# EAGLE design main (EAGLE 6.2)
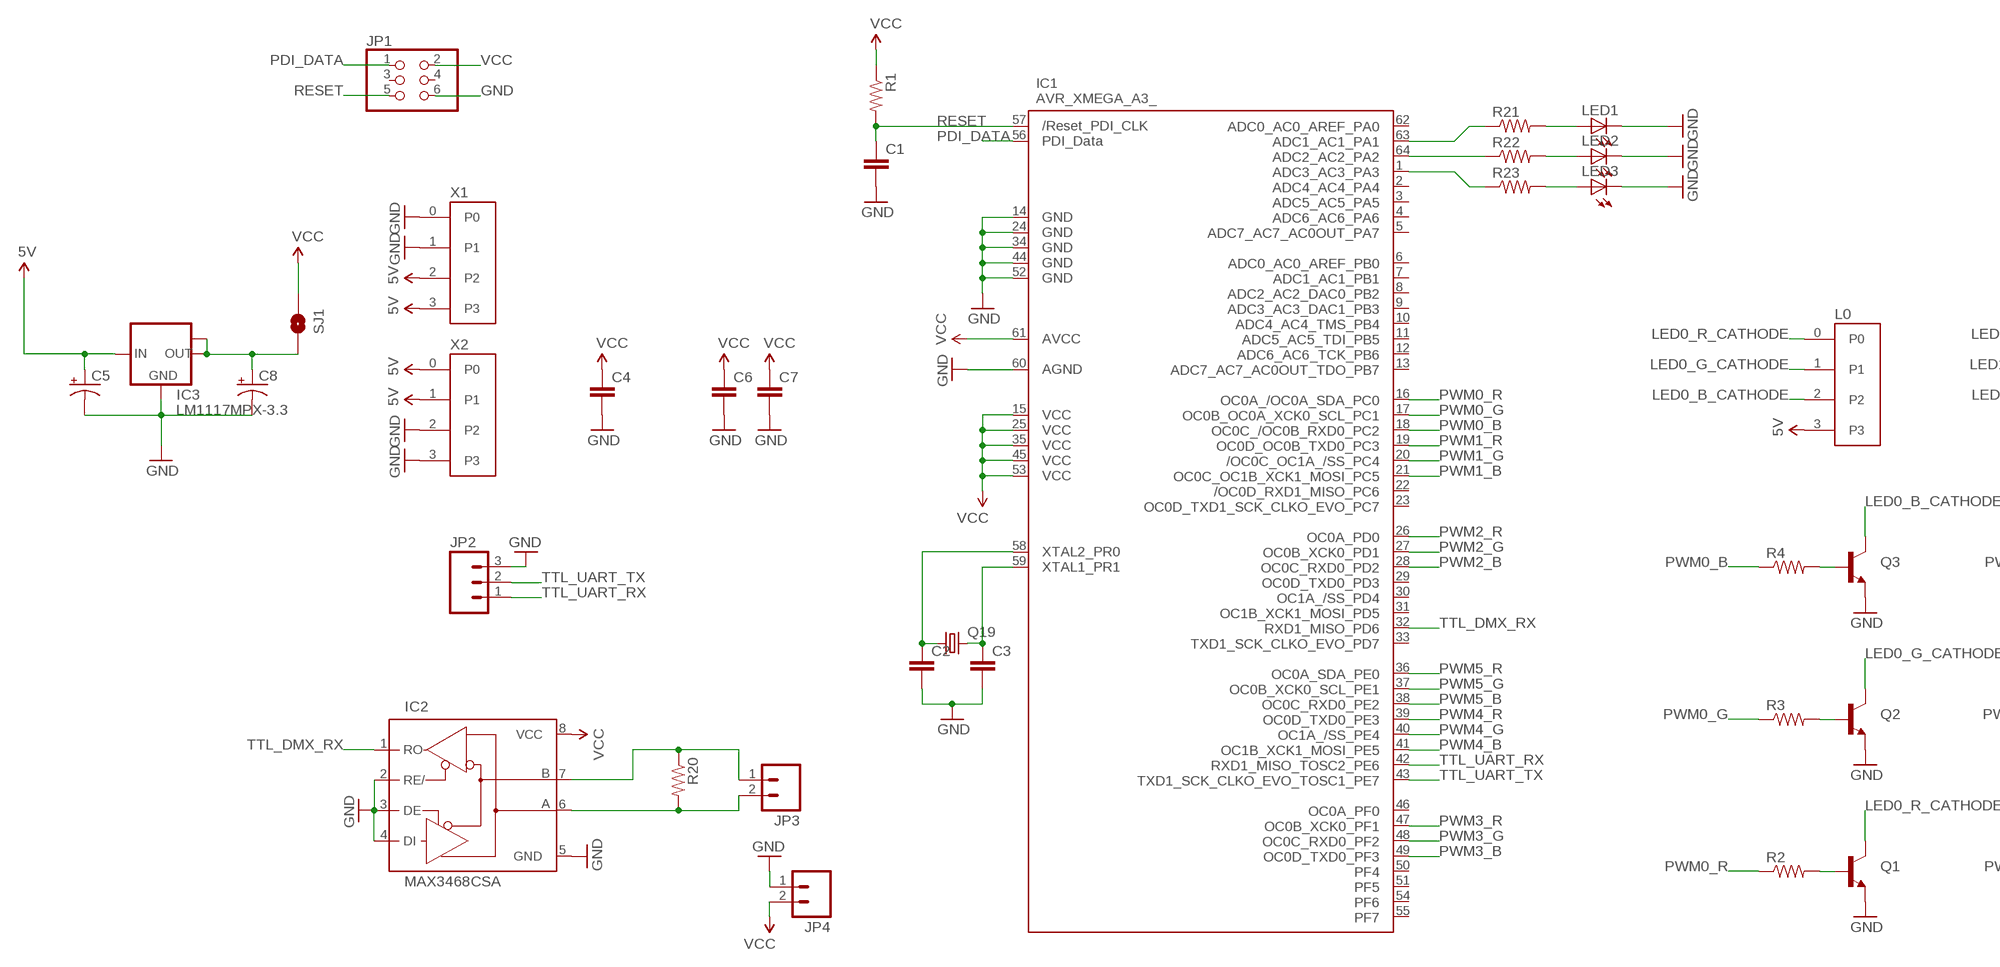
[diagram p0: schematic, sheet 1, part 1 of 2]
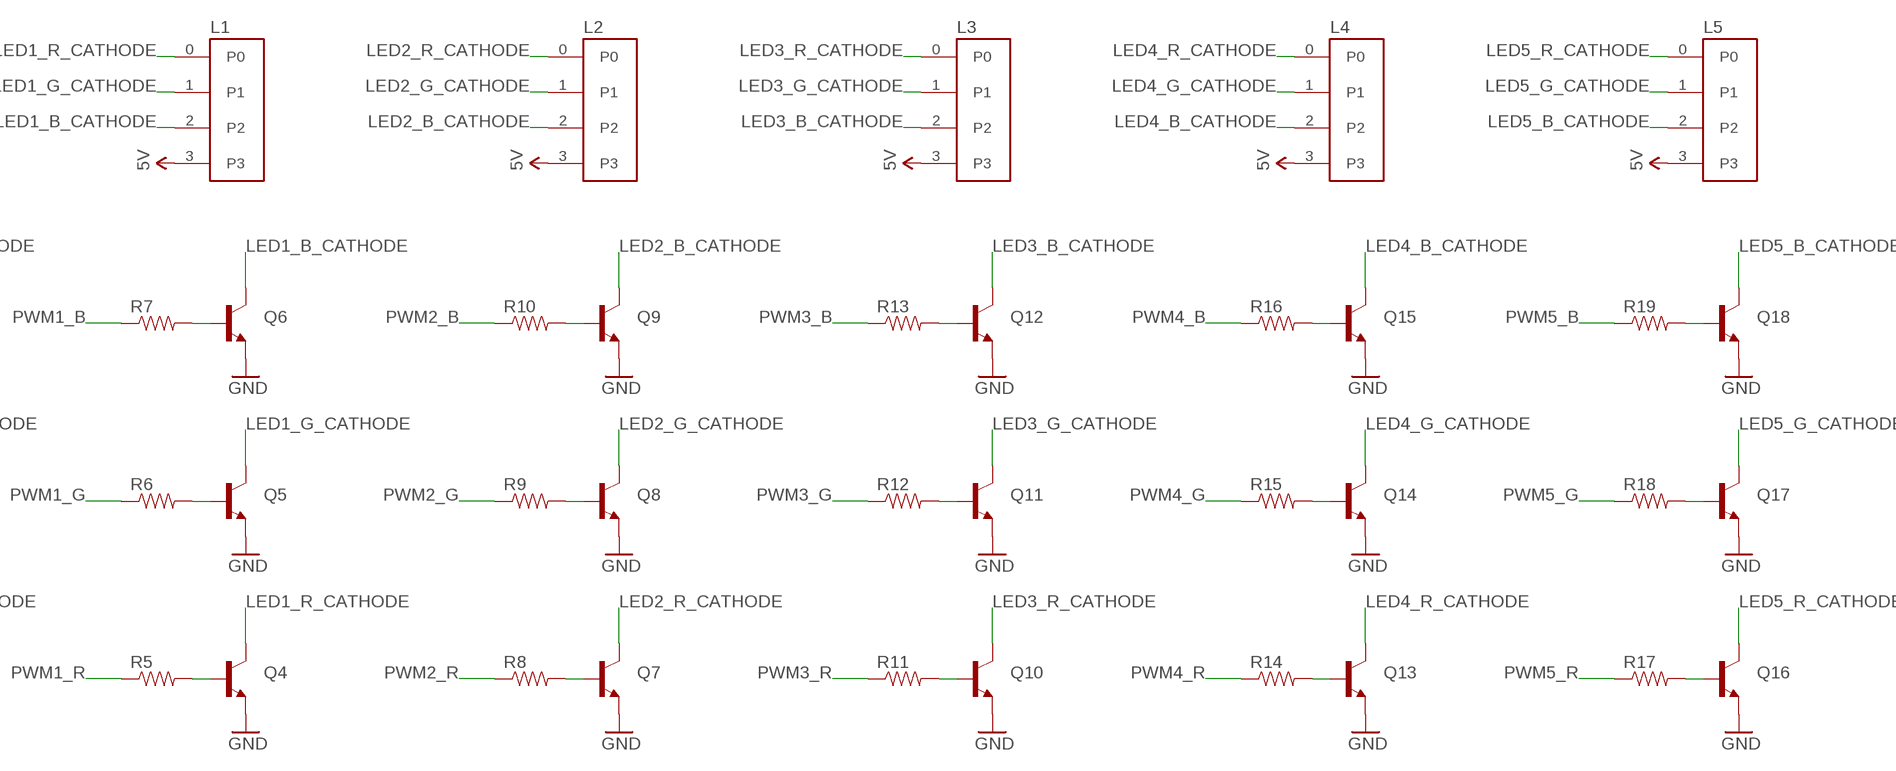
[diagram p1: schematic, sheet 1, part 2 of 2]

## Parts
C1  CAP0805  [0805]
C2  CAP0805  [0805]
C3  CAP0805  [0805]
C4  CAP0805  [0805]
C5  CAP_POLSMD  [VISHAY_C]
C6  CAP0805  [0805]
C7  CAP0805  [0805]
C8  CAP_POLSMD  [VISHAY_C]
IC1  AVR_XMEGA_A3_  [TQFP64]
IC2  MAX3468CSA  [SO08]
IC3  LM1117MPX-3.3  [SOT223]
JP1  PINHD-2X3  [2X03]
JP2  M03LOCK_LONGPADS  [1X03_LOCK_LONGPADS]
JP3  M02  [1X02_LONGPADS]
JP4  M02  [1X02_LONGPADS]
L0  SCREW-TERMINAL-4P  [SK-CZZ-4P]
L1  SCREW-TERMINAL-4P  [SK-CZZ-4P]
L2  SCREW-TERMINAL-4P  [SK-CZZ-4P]
L3  SCREW-TERMINAL-4P  [SK-CZZ-4P]
L4  SCREW-TERMINAL-4P  [SK-CZZ-4P]
L5  SCREW-TERMINAL-4P  [SK-CZZ-4P]
LED1  LEDCHIPLED_0805  [CHIPLED_0805]
LED2  LEDCHIPLED_0805  [CHIPLED_0805]
LED3  LEDCHIPLED_0805  [CHIPLED_0805]
Q1  TRANSISTOR_NPNSOT89  [SOT89]
Q2  TRANSISTOR_NPNSOT89  [SOT89]
Q3  TRANSISTOR_NPNSOT89  [SOT89]
Q4  TRANSISTOR_NPNSOT89  [SOT89]
Q5  TRANSISTOR_NPNSOT89  [SOT89]
Q6  TRANSISTOR_NPNSOT89  [SOT89]
Q7  TRANSISTOR_NPNSOT89  [SOT89]
Q8  TRANSISTOR_NPNSOT89  [SOT89]
Q9  TRANSISTOR_NPNSOT89  [SOT89]
Q10  TRANSISTOR_NPNSOT89  [SOT89]
Q11  TRANSISTOR_NPNSOT89  [SOT89]
Q12  TRANSISTOR_NPNSOT89  [SOT89]
Q13  TRANSISTOR_NPNSOT89  [SOT89]
Q14  TRANSISTOR_NPNSOT89  [SOT89]
Q15  TRANSISTOR_NPNSOT89  [SOT89]
Q16  TRANSISTOR_NPNSOT89  [SOT89]
Q17  TRANSISTOR_NPNSOT89  [SOT89]
Q18  TRANSISTOR_NPNSOT89  [SOT89]
Q19  CRYSTALHC49UP  [HC49UP]
R1  RESISTOR  [0805]
R2  RESISTOR  [0805]
R3  RESISTOR  [0805]
R4  RESISTOR  [0805]
R5  RESISTOR  [0805]
R6  RESISTOR  [0805]
R7  RESISTOR  [0805]
R8  RESISTOR  [0805]
R9  RESISTOR  [0805]
R10  RESISTOR  [0805]
R11  RESISTOR  [0805]
R12  RESISTOR  [0805]
R13  RESISTOR  [0805]
R14  RESISTOR  [0805]
R15  RESISTOR  [0805]
R16  RESISTOR  [0805]
R17  RESISTOR  [0805]
R18  RESISTOR  [0805]
R19  RESISTOR  [0805]
R20  RESISTOR  [0805]
R21  RESISTOR  [0805]
R22  RESISTOR  [0805]
R23  RESISTOR  [0805]
SJ1  SOLDERJUMPERNO  [SJ_2S-NO]
X1  SCREW-TERMINAL-4P  [SK-CZZ-4P]
X2  SCREW-TERMINAL-4P  [SK-CZZ-4P]

## Nets
5V: C5.+ IC3.3(IN) L0.3 L1.3 L2.3 L3.3 L4.3 L5.3 X1.2 X1.3 X2.0 X2.1
GND: C1.2 C2.2 C3.2 C4.2 C5.- C6.2 C7.2 C8.- IC1.14(GND1) IC1.24(GND2) IC1.34(GND3) IC1.44(GND4) IC1.52(GND5) IC1.60(AGND) IC2.2(RE/) IC2.3(DE) IC2.4(DI) IC2.5(GND) IC3.1(GND) JP1.6 JP2.3 JP4.1 LED1.C LED2.C LED3.C Q1.3(E) Q2.3(E) Q3.3(E) Q4.3(E) Q5.3(E) Q6.3(E) Q7.3(E) Q8.3(E) Q9.3(E) Q10.3(E) Q11.3(E) Q12.3(E) Q13.3(E) Q14.3(E) Q15.3(E) Q16.3(E) Q17.3(E) Q18.3(E) X1.0 X1.1 X2.2 X2.3
LED0_B_CATHODE: L0.2 Q3.2(C)
LED0_G_CATHODE: L0.1 Q2.2(C)
LED0_R_CATHODE: L0.0 Q1.2(C)
LED1_B_CATHODE: L1.2 Q6.2(C)
LED1_G_CATHODE: L1.1 Q5.2(C)
LED1_R_CATHODE: L1.0 Q4.2(C)
LED2_B_CATHODE: L2.2 Q9.2(C)
LED2_G_CATHODE: L2.1 Q8.2(C)
LED2_R_CATHODE: L2.0 Q7.2(C)
LED3_B_CATHODE: L3.2 Q12.2(C)
LED3_G_CATHODE: L3.1 Q11.2(C)
LED3_R_CATHODE: L3.0 Q10.2(C)
LED4_B_CATHODE: L4.2 Q15.2(C)
LED4_G_CATHODE: L4.1 Q14.2(C)
LED4_R_CATHODE: L4.0 Q13.2(C)
LED5_B_CATHODE: L5.2 Q18.2(C)
LED5_G_CATHODE: L5.1 Q17.2(C)
LED5_R_CATHODE: L5.0 Q16.2(C)
N$1: Q1.1(B) R2.2
N$2: Q2.1(B) R3.2
N$3: Q3.1(B) R4.2
N$4: Q4.1(B) R5.2
N$5: Q5.1(B) R6.2
N$6: Q6.1(B) R7.2
N$7: Q7.1(B) R8.2
N$8: Q8.1(B) R9.2
N$9: Q9.1(B) R10.2
N$10: Q10.1(B) R11.2
N$11: Q11.1(B) R12.2
N$12: Q12.1(B) R13.2
N$13: Q13.1(B) R14.2
N$14: Q14.1(B) R15.2
N$15: Q15.1(B) R16.2
N$16: Q16.1(B) R17.2
N$17: Q17.1(B) R18.2
N$18: Q18.1(B) R19.2
N$19: C2.1 IC1.58(PR0) Q19.1
N$20: C3.1 IC1.59(PR1) Q19.2
N$21: IC2.7(B) JP3.1 R20.1
N$22: IC2.6(A) JP3.2 R20.2
N$23: IC1.63(PA1) R21.1
N$24: C8.+ IC3.2(OUT) IC3.TAB(OUT1) SJ1.2
N$25: IC1.64(PA2) R22.1
N$26: IC1.1(PA3) R23.1
N$27: LED1.A R21.2
N$28: LED2.A R22.2
N$29: LED3.A R23.2
PDI_DATA: IC1.56(PDI_DATA) JP1.1
PWM0_B: IC1.18(PC2) R4.1
PWM0_G: IC1.17(PC1) R3.1
PWM0_R: IC1.16(PC0) R2.1
PWM1_B: IC1.21(PC5) R7.1
PWM1_G: IC1.20(PC4) R6.1
PWM1_R: IC1.19(PC3) R5.1
PWM2_B: IC1.28(PD2) R10.1
PWM2_G: IC1.27(PD1) R9.1
PWM2_R: IC1.26(PD0) R8.1
PWM3_B: IC1.49(PF3) R13.1
PWM3_G: IC1.48(PF2) R12.1
PWM3_R: IC1.47(PF1) R11.1
PWM4_B: IC1.41(PE5) R16.1
PWM4_G: IC1.40(PE4) R15.1
PWM4_R: IC1.39(PE3) R14.1
PWM5_B: IC1.38(PE2) R19.1
PWM5_G: IC1.37(PE1) R18.1
PWM5_R: IC1.36(PE0) R17.1
RESET: C1.1 IC1.57(RESET) JP1.5 R1.2
TTL_DMX_RX: IC1.32(PD6) IC2.1(RO)
TTL_UART_RX: IC1.42(PE6) JP2.1
TTL_UART_TX: IC1.43(PE7) JP2.2
VCC: C4.1 C6.1 C7.1 IC1.15(VCC1) IC1.25(VCC2) IC1.35(VCC3) IC1.45(VCC4) IC1.53(VCC5) IC1.61(AVCC) IC2.8(VCC) JP1.2 JP4.2 R1.1 SJ1.1
Unconnected: IC1.2(PA4) IC1.3(PA5) IC1.4(PA6) IC1.5(PA7) IC1.6(PB0) IC1.7(PB1) IC1.8(PB2) IC1.9(PB3) IC1.10(PB4) IC1.11(PB5) IC1.12(PB6) IC1.13(PB7) IC1.22(PC6) IC1.23(PC7) IC1.29(PD3) IC1.30(PD4) IC1.31(PD5) IC1.33(PD7) IC1.46(PF0) IC1.50(PF4) IC1.51(PF5) IC1.54(PF6) IC1.55(PF7) IC1.62(PA0) JP1.3 JP1.4

## Library data of the parts
C1-C4 C6 C7 = SparkFun:CAP: Capacitor Standard 0603 ceramic capacitor, and 0.1" leaded capacitor.
C5 C8 = SparkFun:CAP_POL: Capacitor Polarized These are standard SMD and PTH capacitors. Normally 10uF, 47uF, and 100uF in electrolytic and tantalum varieties. Always verify the external diameter of the through hole cap, it varies with capacity, voltage, and manufacturer. The EIA devices should be standard.
IC1 = xmega:AVR_XMEGA_A3_: Device for Atmel AVR XMEGA A3 Series
IC2 = maxim:MAX34*: +5V, Fail-Safe, 40Mbps, Profibus RS-485/RS-422 Transceivers Source: MAX3465-MAX3469.pdf
IC3 = lm1117:LM1117MPX-*
JP1 = SparkFun:PINHD-2X3: PIN HEADER
JP2 = SparkFun:M03: Header 3 Standard 3-pin 0.1" header. Use with straight break away headers (SKU : PRT-00116), right angle break away headers (PRT-00553), swiss pins (PRT-00743), machine pins (PRT-00117), and female headers (PRT-00115). Molex polarized connector foot print use with SKU : PRT-08232 with associated crimp pins and housings.
JP3 JP4 = SparkFun:M02: Header 2 Standard 2-pin 0.1" header. Use with straight break away headers (SKU : PRT-00116), right angle break away headers (PRT-00553), swiss pins (PRT-00743), machine pins (PRT-00117), and female headers (PRT-00115). Molex polarized connector foot print use with SKU : PRT-08233 with associated crimp pins and housings.
L0 L1-L5 X1 X2 = terminals:SCREW-TERMINAL-4P: Screw Terminal from Stelvio-Kontek https://www1.elfa.se/data1/wwwroot/assets/datasheets/04837407.pdf Elfa: 48-375-22
LED1-LED3 = led:LED: LED OSRAM: - CHIPLED LG R971, LG N971, LY N971, LG Q971, LY Q971, LO R971, LY R971 LH N974, LH R974 LS Q976, LO Q976, LY Q976 LO Q996 - Hyper CHIPLED LW Q18S LB Q993, LB Q99A, LB R99A - SideLED LS A670, LO A670, LY A670, LG A670, LP A670 LB A673, LV A673, LT A673, LW A673 LH A674 LY A675 LS A676, LA A676, LO A676, LY A676, LW A676 LS A679, LY A679, LG A679 - Hyper Micro SIDELED® LS Y876, LA Y876, LO Y876, LY Y876 LT Y87S - SmartLED LW L88C, LW L88S LB L89C, LB L89S, LG L890 LS L89K, LO L89K, LY L89K LS L896, LA L896, LO L896, LY L896 - TOPLED LS T670, LO T670, LY T670, LG T670, LP T670 LSG T670, LSP T670, LSY T670, LOP T670, LYG T670 LG T671, LOG T671, LSG T671 LB T673, LV T673, LT T673, LW T673 LH T674 LS T676, LA T676, LO T676, LY T676, LB T676, LH T676, LSB T676, LW T676 LB T67C, LV T67C, LT T67C, LS T67K, LO T67K, LY T67K, LW E67C LS E67B, LA E67B, LO E67B, LY E67B, LB E67C, LV E67C, LT E67C LW T67C LS T679, LY T679, LG T679 LS T770, LO T770, LY T770, LG T770, LP T770 LB T773, LV T773, LT T773, LW T773 LH T774 LS E675, LA E675, LY E675, LS T675 LS T776, LA T776, LO T776, LY T776, LB T776 LHGB T686 LT T68C, LB T68C - Hyper Mini TOPLED® LB M676 - Mini TOPLED Santana® LG M470 LS M47K, LO M47K, LY M47K Source: http://www.osram.convergy.de LUXEON: - LUMILED® LXK2-PW12-R00, LXK2-PW12-S00, LXK2-PW14-U00, LXK2-PW14-V00 LXK2-PM12-R00, LXK2-PM12-S00, LXK2-PM14-U00 LXK2-PE12-Q00, LXK2-PE12-R00, LXK2-PE12-S00, LXK2-PE14-T00, LXK2-PE14-U00 LXK2-PB12-K00, LXK2-PB12-L00, LXK2-PB12-M00, LXK2-PB14-N00, LXK2-PB14-P00, LXK2-PB14-Q00 LXK2-PR12-L00, LXK2-PR12-M00, LXK2-PR14-Q00, LXK2-PR14-R00 LXK2-PD12-Q00, LXK2-PD12-R00, LXK2-PD12-S00 LXK2-PH12-R00, LXK2-PH12-S00 LXK2-PL12-P00, LXK2-PL12-Q00, LXK2-PL12-R00 Source: www.luxeon.com KINGBRIGHT: KA-3528ASYC Source: www.kingbright.com
Q1-Q18 = sot89_lengrebein:TRANSISTOR_NPN: Transistor NPN BJT configuration in SOT23 package. MMBT2222 is the common NPN we use. Double check BCE configuration again layout.
Q19 = crystal:CRYSTAL: CRYSTAL
R1-R23 = SparkFun:RESISTOR: Resistor Basic schematic elements and footprints for 0603, 1206, and PTH 1/10th watt (small) resistors.
SJ1 = SparkFun:SOLDERJUMPER: Solder Jumper Standard SMD solder jumper. Used to automate production. Two varients : Normally Open and Normally Closed are the same, but have different paste layers. NC will have a large amount of paste and should jumper during reflow.

## Board
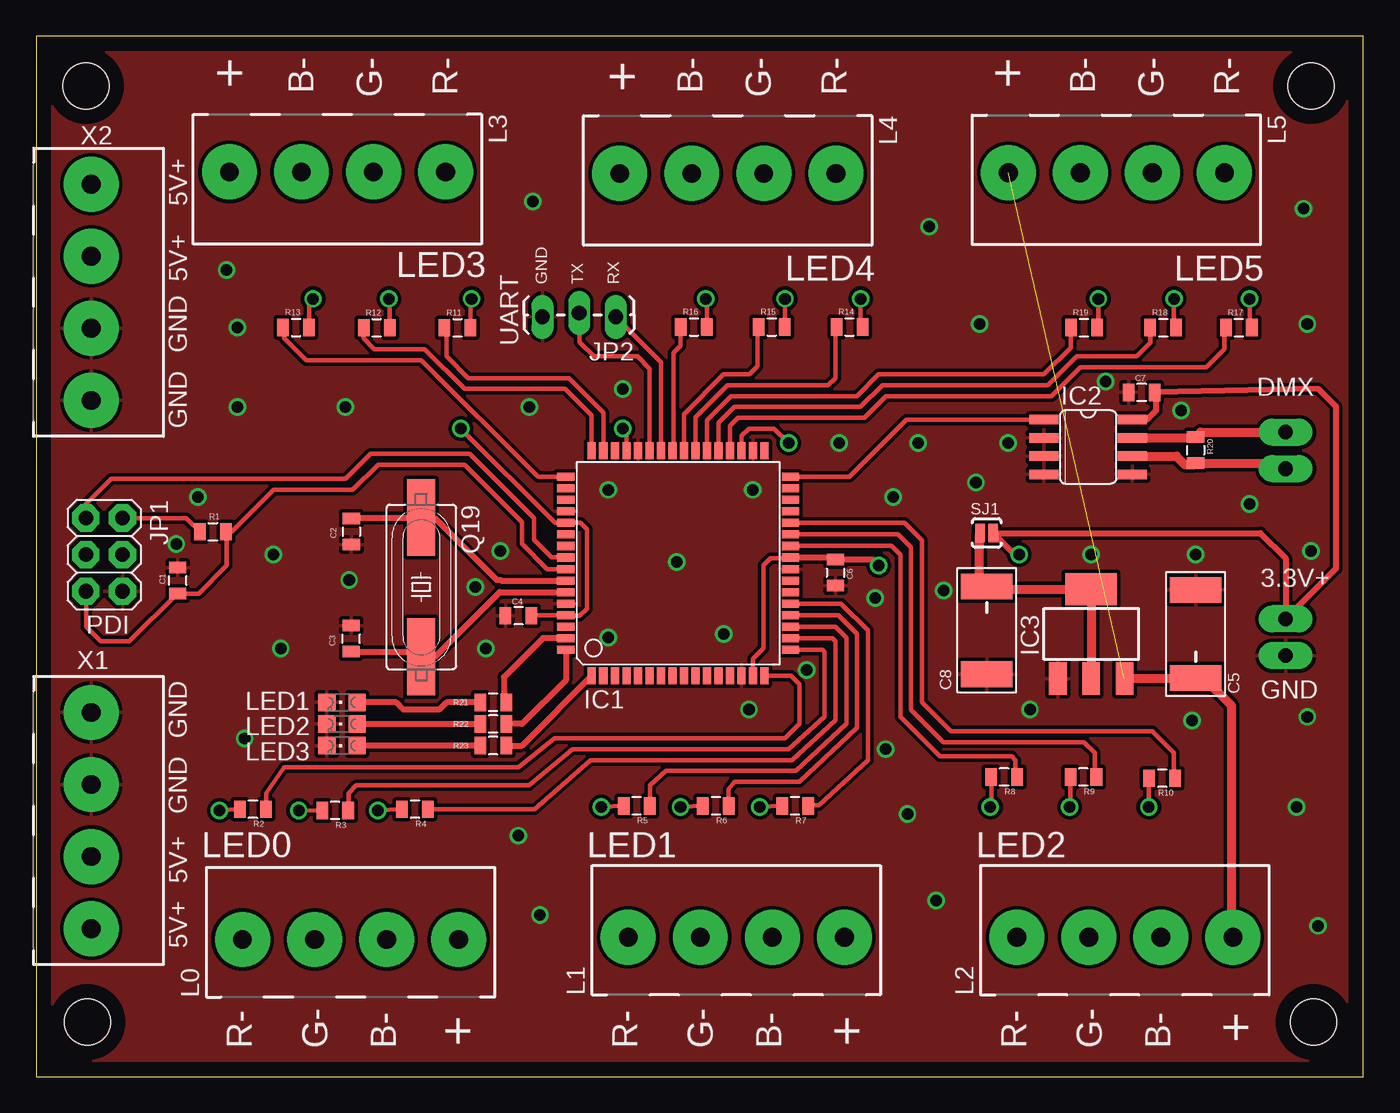
[diagram p2: board, top side]
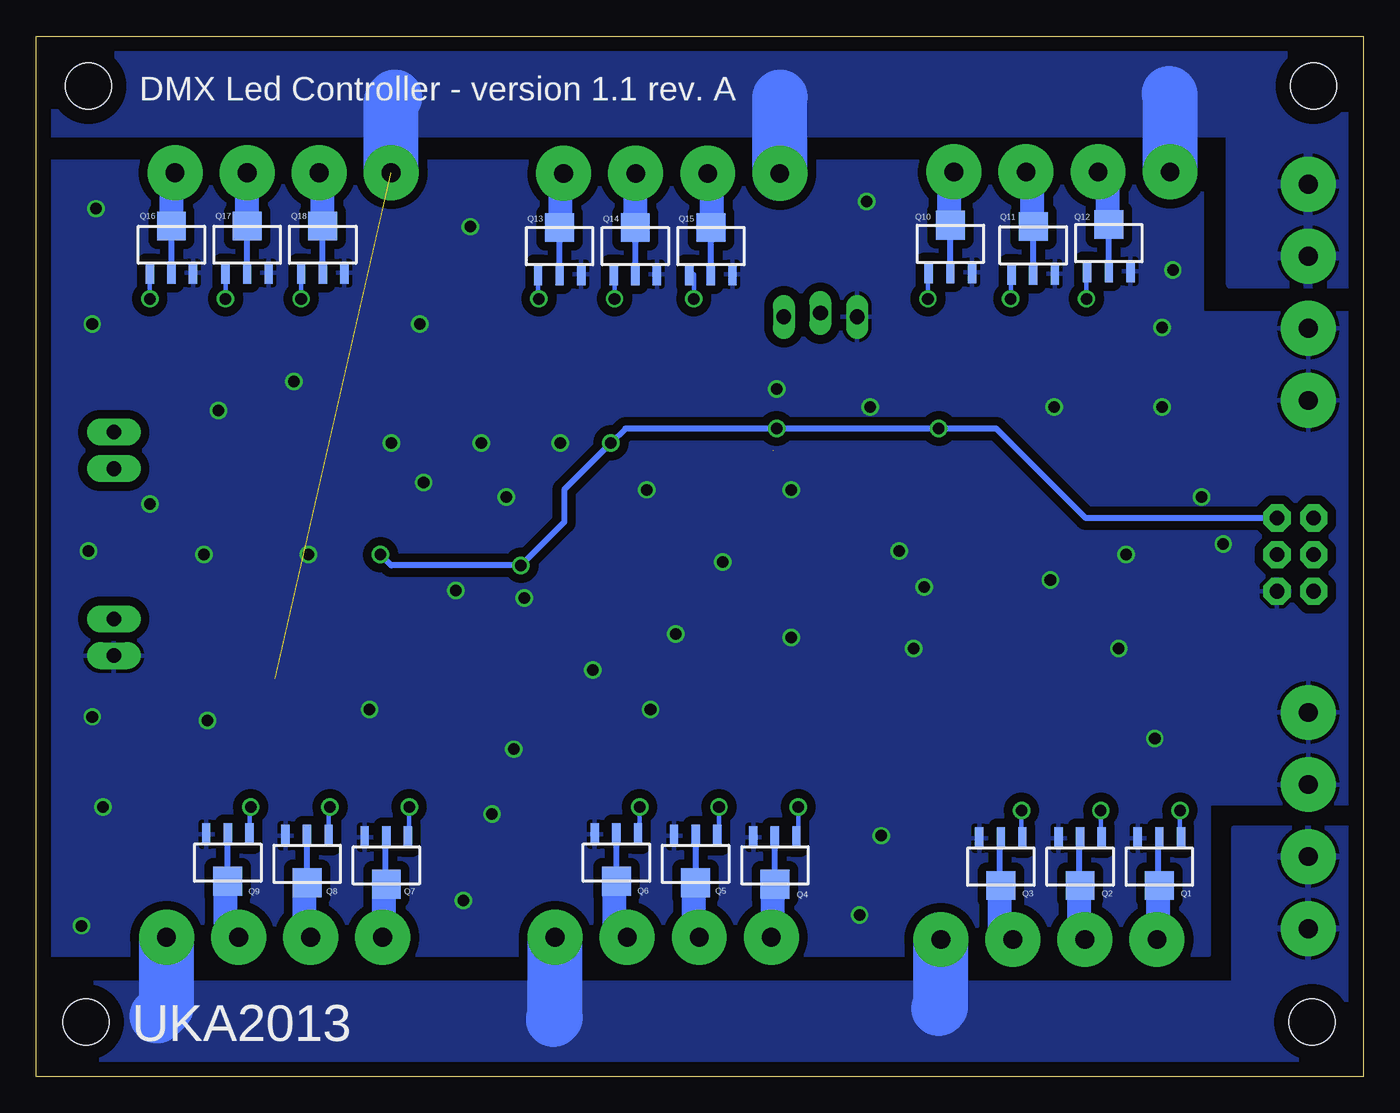
[diagram p3: board, bottom side, seen from below]

Size 92.13 x 72.21 mm. Coordinates in mm from the lower left corner, seen from the top.
Outline: 0,0 92.13,0 92.13,72.21 0,72.21 0,0
Copper layers (1*16): Top 0.035mm / dielectric 1.5mm / Bottom 0.035mm
Design rules: minimum track width 10mil, minimum drill 24mil, track to track 8mil, track to pad 8mil, pad to pad 8mil, via to via 8mil, smd to smd 8mil, copper to edge 40mil, drill to drill 8mil, minimum pad ring 10mil, minimum via ring 8mil, stop-mask expansion 4mil, vias tented up to drill 0mil, thermal gap 10mil
Holes 3.2 mm at 3.56,3.81 88.65,3.81 3.48,68.73 88.48,68.73

### Footprints (pad centres in the part's own frame; a part is rotated, then mirrored left to right if it is on the bottom)
0805 = smd 0.8 x 1.2: 1 -0.9,0; 2 0.9,0
VISHAY_C = smd 3.556 x 1.778: + 0,3.048; - 0,-3.048
TQFP64 = smd 1.194 x 0.559: 1 -7.8,6; 2 -7.8,5.2; 3 -7.8,4.4; 4 -7.8,3.6; 5 -7.8,2.8; 6 -7.8,2; 7 -7.8,1.2; 8 -7.8,0.4; 9 -7.8,-0.4; 10 -7.8,-1.2; 11 -7.8,-2; 12 -7.8,-2.8; 13 -7.8,-3.6; 14 -7.8,-4.4; 15 -7.8,-5.2; 16 -7.8,-6; 33 7.8,-6; 34 7.8,-5.2; 35 7.8,-4.4; 36 7.8,-3.6; 37 7.8,-2.8; 38 7.8,-2; 39 7.8,-1.2; 40 7.8,-0.4; 41 7.8,0.4; 42 7.8,1.2; 43 7.8,2; 44 7.8,2.8; 45 7.8,3.6; 46 7.8,4.4; 47 7.8,5.2; 48 7.8,6 | smd 0.559 x 1.194: 17 -6,-7.8; 18 -5.2,-7.8; 19 -4.4,-7.8; 20 -3.6,-7.8; 21 -2.8,-7.8; 22 -2,-7.8; 23 -1.2,-7.8; 24 -0.4,-7.8; 25 0.4,-7.8; 26 1.2,-7.8; 27 2,-7.8; 28 2.8,-7.8; 29 3.6,-7.8; 30 4.4,-7.8; 31 5.2,-7.8; 32 6,-7.8; 49 6,7.8; 50 5.2,7.8; 51 4.4,7.8; 52 3.6,7.8; 53 2.8,7.8; 54 2,7.8; 55 1.2,7.8; 56 0.4,7.8; 57 -0.4,7.8; 58 -1.2,7.8; 59 -2,7.8; 60 -2.8,7.8; 61 -3.6,7.8; 62 -4.4,7.8; 63 -5.2,7.8; 64 -6,7.8
SO08 = smd 0.66 x 2.032: 1 -1.905,-3.073; 2 -0.635,-3.073; 3 0.635,-3.073; 4 1.905,-3.073; 5 1.905,3.073; 6 0.635,3.073; 7 -0.635,3.073; 8 -1.905,3.073
SOT223 = smd 1.219 x 2.235: 1 -2.311,-3.099; 2 0,-3.099; 3 2.311,-3.099 | smd 3.6 x 2.2: TAB 0,3.099
2X03 = drill 1.016 pad 1.88 octagon: 1 -2.54,-1.27; 2 -2.54,1.27; 3 0,-1.27; 4 0,1.27; 5 2.54,-1.27; 6 2.54,1.27
1X03_LOCK_LONGPADS = drill 1.016 long: 1 0,0; 2 2.54,-0.254; 3 5.08,0
1X02_LONGPADS = drill 1.016 pad 1.88 long: 1 0,0; 2 2.54,0
SK-CZZ-4P = drill 1.3 pad 3.81: 0 -0.5,7.5; 1 -0.5,2.5; 2 -0.5,-2.5; 3 -0.5,-7.5
CHIPLED_0805 = smd 1.2 x 1.2: A 0,-1.05; C 0,1.05
SOT89 = smd 0.58 x 1.524: 1 -1.5,-1.96; 2 0,-1.96; 3 1.5,-1.96 | smd 2 x 2: 4 0,1.3
HC49UP = smd 5.334 x 1.93: 1 -4.826,0; 2 4.826,0
SJ_2S-NO = smd 0.635 x 1.27: 1 -0.45,0; 2 0.45,0

### Placement (x,y rotation side)
C1  9.83,34.43 90 top
C2  21.88,37.82 270 top
C3  21.87,30.4 90 top
C4  33.48,31.98 180 top
C5  80.48,30.73 180 top
C6  55.48,34.98 270 top
C7  76.73,47.48 180 top
C8  65.98,30.98 0 top
IC1  44.57,35.63 90 top
IC2  73.02,43.7 270 top
IC3  73.23,30.73 0 top
JP1  4.73,36.23 270 top
JP2  40.23,52.73 180 top
JP3  86.73,44.73 270 top
JP4  86.73,29.23 90 top
L0  21.83,10.03 90 top
L1  48.6,10.18 90 top
L2  75.57,10.18 90 top
L3  20.92,62.28 270 top
L4  48.01,62.18 270 top
L5  74.98,62.23 270 top
LED1  21.23,25.98 90 top
LED2  21.23,24.48 90 top
LED3  21.23,22.98 90 top
Q1  14.17,14.58 180 bottom
Q2  19.67,14.58 180 bottom
Q3  25.17,14.58 180 bottom
Q4  40.85,14.67 180 bottom
Q5  46.35,14.77 180 bottom
Q6  51.85,14.87 180 bottom
Q7  67.82,14.67 180 bottom
Q8  73.32,14.77 180 bottom
Q9  78.82,14.87 180 bottom
Q10  28.67,57.79 0 bottom
Q11  22.92,57.69 0 bottom
Q12  17.67,57.84 0 bottom
Q13  55.79,57.63 0 bottom
Q14  50.54,57.63 0 bottom
Q15  45.29,57.63 0 bottom
Q16  82.73,57.73 0 bottom
Q17  77.48,57.73 0 bottom
Q18  72.23,57.73 0 bottom
Q19  26.73,33.98 270 top
R1  12.28,37.82 0 top
R2  15.06,18.56 180 top
R3  20.76,18.47 180 top
R4  26.3,18.56 180 top
R5  41.69,18.8 180 top
R6  47.19,18.8 180 top
R7  52.68,18.8 180 top
R8  67.19,20.8 180 top
R9  72.69,20.8 180 top
R10  78.16,20.71 180 top
R11  29.25,51.96 0 top
R12  23.65,51.96 0 top
R13  18.05,51.99 0 top
R14  56.46,52.02 0 top
R15  51.06,52.02 0 top
R16  45.66,52.02 0 top
R17  83.48,51.98 0 top
R18  78.23,51.98 0 top
R19  72.73,51.98 0 top
R20  80.48,43.48 270 top
R21  31.73,25.98 180 top
R22  31.73,24.48 180 top
R23  31.73,22.98 180 top
SJ1  65.98,37.73 180 top
X1  4.33,17.78 0 top
X2  4.33,54.43 0 top

### Tracks (layer width: path | path; a pad name or v marks a point on that pad's centre or on a via)
5V  (1 unrouted)
  Top 0.61: IC3.3 80.43,27.63 C5.+ 81.03,27.68 82.98,25.73 82.98,9.77 L2.3
  Bottom 3.81: L0.3 29.33,4.88 29.48,4.73 | L1.3 56.1,4.11 56.23,3.98 | L2.3 83.07,4.89 83.73,4.23 | L3.3 13.42,68.17 13.48,68.23 | L4.3 40.51,67.95 40.48,67.98 | L5.3 67.48,67.73 67.23,67.98
  pour Bottom: -0.27,-0.02 92.23,-0.02 92.23,6.48 8.98,6.48 8.98,17.23 -0.27,17.23
  pour Bottom: -0.27,72.23 -0.27,54.98 9.23,54.98 9.23,65.48 92.23,65.48 92.23,72.23
GND  (via drill 0.8)
  other vias: 44.48,35.73 39.73,40.73 49.73,40.73 47.73,30.73 39.73,30.48 87.48,18.73 61.23,43.98 67.48,43.98 65.23,41.23 59.48,40.23 88.48,36.48 84.23,39.73 79.48,46.23 68.98,25.48 80.23,24.73 73.23,36.23 62.98,33.73 58.23,33.23 58.98,22.73 55.73,43.98 74.23,48.23 34.23,46.48 40.73,47.73 11.23,40.23 9.73,36.98 21.73,34.48 30.48,33.98 16.48,36.23 16.98,29.73 32.23,36.48 21.48,46.48 13.98,46.48 13.98,51.98 34.48,60.73 61.98,58.98 65.48,52.23 87.98,60.23 88.23,52.23 88.98,10.48 62.48,12.23 34.98,11.23 33.48,16.73 31.23,29.73 49.48,25.48 13.23,55.98 80.48,36.23 88.23,24.98 60.48,18.23 14.48,23.48 53.48,28.23
  pour Bottom (isolate 0.61): -0.02,52.98 -0.02,18.98 10.73,18.98 10.73,8.48 92.23,8.48 92.23,63.48 11.23,63.48 11.23,52.98
  pour Top (isolate 0.254): -0.27,72.23 -0.27,-0.02 92.23,-0.02 92.23,72.23
LED0_B_CATHODE
  Bottom 0.406: 25.23,13.48 25.23,16.48 Q3.2
  Bottom 1.676: L0.2 24.53,9.53 25.23,10.23 25.23,13.48
LED0_G_CATHODE
  Bottom 0.406: 19.73,13.23 19.73,16.48 Q2.2
  Bottom 1.676: L0.1 19.73,9.53 19.73,13.23
LED0_R_CATHODE
  Bottom 0.406: 14.23,13.23 14.23,16.48 Q1.2
  Bottom 1.676: L0.0 14.23,9.53 14.23,13.23
LED1_B_CATHODE
  Bottom 0.406: 51.98,13.73 51.98,14.11 51.84,14.25 Q6.2
  Bottom 1.676: L1.2 51.18,9.68 51.98,10.48 51.98,13.73
LED1_G_CATHODE
  Bottom 0.406: 46.48,13.48 46.48,13.92 46.34,14.06 Q5.2
  Bottom 1.676: L1.1 46.1,10.35 46.48,10.73 46.48,13.48
LED1_R_CATHODE
  Bottom 0.406: 40.98,13.48 40.98,13.88 40.86,14.01 Q4.2
  Bottom 1.676: L1.0 41.1,10.61 40.98,10.73 40.98,13.48
LED2_B_CATHODE
  Bottom 0.406: 78.98,13.73 78.98,13.85 78.82,14.01 Q9.2 | Q9.2
  Bottom 1.676: L2.2 78.07,9.82 78.98,10.73 78.98,13.73
LED2_G_CATHODE
  Bottom 0.406: 73.48,13.48 73.48,13.84 73.32,14.01 Q8.2
  Bottom 1.676: L2.1 73.07,10.07 73.48,10.48 73.48,13.48
LED2_R_CATHODE
  Bottom 0.406: 67.98,13.23 67.98,14.1 67.85,14.23 67.85,16.6 Q7.2
  Bottom 1.676: L2.0 68.07,10.89 67.98,10.98 67.98,13.23
LED3_B_CATHODE
  Bottom 0.406: Q12.2 17.67,58.92 17.73,58.98
  Bottom 1.676: L3.2 18.42,62.42 17.73,61.73 17.73,58.98
LED3_G_CATHODE
  Bottom 0.406: Q11.2 22.92,58.92 22.98,58.98
  Bottom 1.676: L3.1 23.42,62.17 22.98,61.73 22.98,58.98
LED3_R_CATHODE
  Bottom 0.406: Q10.2 28.67,59.42 28.73,59.48
  Bottom 1.676: L3.0 28.42,61.79 28.73,61.48 28.73,59.48 28.73,58.98
LED4_B_CATHODE
  Bottom 0.406: Q15.2 45.29,58.67 45.23,58.73
  Bottom 1.676: L4.2 45.51,61.76 45.23,61.48 45.23,58.73
LED4_G_CATHODE
  Bottom 0.406: Q14.2 50.54,58.67 50.48,58.73
  Bottom 1.676: L4.1 50.51,58.76 50.48,58.73
LED4_R_CATHODE
  Bottom 0.406: Q13.2 55.79,59.17 55.73,59.23
  Bottom 1.676: L4.0 55.51,61.7 55.73,61.48 55.73,59.23 55.73,58.73
LED5_B_CATHODE
  Bottom 0.406: Q18.2 72.23,58.98
  Bottom 1.676: L5.2 72.48,61.98 72.23,61.73 72.23,58.98
LED5_G_CATHODE
  Bottom 0.406: Q17.2 77.48,58.98
  Bottom 1.676: 77.48,58.98 L5.1
LED5_R_CATHODE
  Bottom 0.406: Q16.2 82.73,58.98
  Bottom 1.676: L5.0 82.48,61.73 82.73,61.48 82.73,58.98
N$1  (via drill 0.8)
  Top 0.305: v12.73,18.48 12.66,18.48 R2.2
  Bottom 0.305: Q1.1 12.73,16.54 v12.73,18.48
N$2  (via drill 0.8)
  Top 0.305: v18.23,18.48 18.16,18.48 R3.2
  Bottom 0.305: Q2.1 18.23,16.54 v18.23,18.48
N$3  (via drill 0.8)
  Top 0.305: v23.73,18.48 23.66,18.48 R4.2
  Bottom 0.305: Q3.1 23.73,16.54 v23.73,18.48
N$4  (via drill 0.8)
  Top 0.305: v39.23,18.73 39.29,18.73 R5.2
  Bottom 0.305: Q4.1 39.23,16.63 v39.23,18.73
N$5  (via drill 0.8)
  Top 0.305: v44.73,18.73 44.78,18.73 R6.2
  Bottom 0.305: Q5.1 44.73,16.73 v44.73,18.73
N$6  (via drill 0.8)
  Top 0.305: v50.23,18.73 50.28,18.73 R7.2
  Bottom 0.305: Q6.1 50.23,16.83 v50.23,18.73
N$7  (via drill 0.8)
  Top 0.305: v66.23,18.73 66.29,18.73 R8.2
  Bottom 0.305: Q7.1 66.23,16.63 v66.23,18.73
N$8  (via drill 0.8)
  Top 0.305: v71.73,18.73 71.79,18.73 R9.2
  Bottom 0.305: Q8.1 71.82,18.64 v71.73,18.73
N$9  (via drill 0.8)
  Top 0.305: v77.23,18.73 77.23,20.68 R10.2
  Bottom 0.305: Q9.1 77.32,18.64 v77.23,18.73
N$10  (via drill 0.8)
  Top 0.305: v30.23,53.98 30.15,53.98 R11.2
  Bottom 0.305: Q10.1 30.23,55.83 v30.23,53.98
N$11  (via drill 0.8)
  Top 0.305: v24.48,53.98 24.55,53.98 R12.2
  Bottom 0.305: Q11.1 24.48,55.73 v24.48,53.98
N$12  (via drill 0.8)
  Top 0.305: v19.23,53.98 18.95,53.98 R13.2
  Bottom 0.305: Q12.1 19.23,55.88 v19.23,53.98
N$13  (via drill 0.8)
  Top 0.305: v57.23,53.98 57.23,52.15 R14.2
  Bottom 0.305: Q13.1 57.29,54.04 v57.23,53.98
N$14  (via drill 0.8)
  Top 0.305: v51.98,53.98 51.98,52.04 R15.2
  Bottom 0.305: Q14.1 51.98,55.67 v51.98,53.98
N$15  (via drill 0.8)
  Top 0.305: v46.48,53.98 46.56,53.98 R16.2
  Bottom 0.305: Q15.1 46.48,55.67 v46.48,53.98
N$16  (via drill 0.8)
  Top 0.305: v84.23,53.98 84.23,52.13 R17.2
  Bottom 0.305: v84.23,53.98 Q16.1
N$17  (via drill 0.8)
  Top 0.305: v78.98,53.98 78.98,52.13 R18.2
  Bottom 0.305: v78.98,53.98 Q17.1
N$18  (via drill 0.8)
  Top 0.305: v73.73,53.98 73.73,52.08 R19.2
  Bottom 0.305: v73.73,53.98 Q18.1
N$19
  Top 0.406: IC1.58 32.28,34.43 32.23,34.48 31.98,34.48 27.73,38.73 26.81,38.73 Q19.1 21.97,38.81 C2.1
N$20
  Top 0.406: C3.1 26.39,29.5 Q19.2 27.7,29.15 32.17,33.62 IC1.59
N$21
  Top 0.61: IC2.7 80.44,44.33 R20.1 80.83,44.73 JP3.1
N$22
  Top 0.61: IC2.6 79.15,43.06 79.73,42.48 80.38,42.48 R20.2 86.34,42.58 JP3.2
N$23
  Top 0.406: IC1.63 35.18,30.43 32.48,27.73 32.48,26.13 R21.1
N$24
  Top 0.61: IC3.2 IC3.TAB 66.18,33.83 C8.+ 65.98,34.23 65.48,34.73 65.48,37.68 SJ1.2
N$25
  Top 0.406: IC1.64 36.77,27.52 33.73,24.48 R22.1
N$26
  Top 0.406: R23.1 33.73,22.98 36.23,25.48 36.23,25.49 IC1.1
N$27
  Top 0.406: R21.2 28.48,25.98 27.98,25.48 25.48,25.48 24.98,25.98 LED1.A
N$28
  Top 0.406: LED2.A R22.2 | R22.2
N$29
  Top 0.406: R23.2 LED3.A
PDI_DATA
  Top 0.305: JP1.1 3.46,39.71 5.23,41.48 21.48,41.48 23.23,43.23 30.1,43.23 34.56,38.77 34.56,37.26 35.79,36.03 IC1.56
PWM0_B
  Top 0.305: IC1.18 55.28,30.43 55.48,30.23 55.48,24.73 52.48,21.98 38.48,21.98 34.6,18.57 30.4,18.57 R4.1
PWM0_G
  Top 0.305: IC1.17 54.58,29.63 54.73,29.48 54.73,24.98 52.23,22.73 37.23,22.73 34.23,20.23 25.48,20.23 22.23,20.23 21.69,19.66 R3.1
PWM0_R
  Top 0.305: IC1.16 52.13,27.83 52.39,27.84 52.98,27.23 52.98,24.48 51.98,23.48 35.98,23.48 33.48,21.48 25.98,21.48 25.73,21.48 19.98,21.48 18.98,21.48 17.23,21.48 | 17.23,21.48 | 17.23,21.48 15.98,19.67 R2.1
PWM1_B
  Top 0.305: IC1.21 55.88,32.83 57.73,30.98 57.73,21.98 54.34,18.84 53.59,18.84 | 53.59,18.84 53.48,18.73 | 53.59,18.84 53.48,18.94 R7.1
PWM1_G
  Top 0.305: IC1.20 55.68,32.03 56.98,30.73 56.98,24.23 52.98,20.48 48.48,20.48 48.07,19.96 R6.1
PWM1_R
  Top 0.305: IC1.19 55.48,31.23 56.23,30.48 56.23,24.48 52.73,21.23 52.48,21.23 51.73,21.23 43.73,21.23 42.6,20.23 42.6,18.94 R5.1
PWM2_B
  Top 0.305: IC1.28 60.28,38.43 61.48,37.23 61.48,25.98 63.48,23.98 77.48,23.98 78.98,22.48 78.98,20.8 R10.1
PWM2_G
  Top 0.305: IC1.27 59.83,37.63 60.73,36.73 60.73,25.48 62.98,23.23 72.73,23.23 73.48,22.48 73.48,20.91 R9.1
PWM2_R
  Top 0.305: IC1.26 59.38,36.83 59.98,36.23 59.98,24.98 62.73,22.23 67.73,22.23 67.98,21.98 67.98,20.91 R8.1
PWM3_B
  Top 0.305: IC1.49 34.83,41.63 26.73,49.73 18.73,49.73 17.23,51.23 17.23,51.91 R13.1
PWM3_G
  Top 0.305: IC1.48 38.57,45.89 36.73,47.73 29.73,47.73 26.98,50.48 23.48,50.48 22.73,51.23 22.73,51.95 R12.1
PWM3_R
  Top 0.305: IC1.47 39.37,46.09 36.98,48.48 29.98,48.48 28.48,49.98 28.48,51.83 R11.1
PWM4_B
  Top 0.305: IC1.41 44.17,43.67 44.23,43.73 44.23,50.23 44.73,50.73 44.73,51.99 R16.1
PWM4_G
  Top 0.305: IC1.40 44.97,45.97 47.73,48.73 49.52,48.73 50.08,49.29 50.08,51.94 R15.1
PWM4_R
  Top 0.305: IC1.39 45.77,45.77 47.98,47.98 54.98,47.98 55.48,48.48 55.48,51.95 R14.1
PWM5_B
  Top 0.305: IC1.38 46.57,45.57 48.23,47.23 56.98,47.23 58.48,48.73 69.95,48.73 71.81,50.6 71.81,51.96 R19.1
PWM5_G
  Top 0.305: IC1.37 47.37,45.37 48.48,46.48 57.23,46.48 58.73,47.98 70.23,47.98 72.23,49.98 76.38,49.98 77.33,50.92 R18.1
PWM5_R
  Top 0.305: IC1.36 48.17,45.17 48.73,45.73 57.48,45.73 58.98,47.23 70.48,47.23 72.48,49.23 81.23,49.23 82.48,50.48 82.48,51.88 R17.1
RESET
  Top 0.305: IC1.57 35.48,35.23 33.73,36.98 33.73,38.48 29.73,42.48 23.73,42.48 21.98,40.73 16.48,40.73 13.58,37.82 R1.2 13.23,37.77 13.23,35.48 11.28,33.53 C1.1 | C1.1 9.93,33.43 | C1.1 9.78,33.53 6.48,30.23 4.48,30.23 3.48,31.23 3.48,33.67 JP1.5
TTL_DMX_RX
  Top 0.305: IC2.1 60.41,45.6 56.44,41.64 IC1.32
TTL_UART_RX
  Top 0.305: IC1.42 43.37,49.59 JP2.1
TTL_UART_TX
  Top 0.305: IC1.43 42.57,49.14 41.73,49.98 38.73,49.98 37.73,50.98 37.73,52.94 JP2.2
VCC  (via drill 0.8)  (1 unrouted)
  Top 0.305: JP1.2 10.43,38.77 R1.1 | 40.98,43.48 40.98,44.73 v40.73,44.98 | IC1.35 48.97,44.47 49.48,44.98 51.23,44.98 v52.23,43.98 | C4.1 34.63,32.03 IC1.61 36.82,31.98 37.73,31.98 38.23,32.48 38.23,37.98 37.78,38.43 IC1.53 36.03,38.43 v29.48,44.98 | IC1.15 49.77,29.02 50.48,29.73 50.48,35.48 50.98,35.98 52.32,35.98 IC1.25
  Top 0.406: IC2.8 77.11,45.6 77.73,46.23 77.73,47.63 C7.1 88.98,47.73 90.23,46.48 90.23,35.27 JP4.2 86.73,35.98 84.98,37.73 SJ1.1 67.93,36.23 v68.23,36.23 | IC1.25 55.33,36.03 C6.1 58.08,35.88 v58.48,35.48
  Bottom 0.305: 40.98,44.98 v40.73,44.98
  Bottom 0.406: v68.23,36.23 67.48,35.48 v58.48,35.48 55.48,38.48 55.48,40.73 v52.23,43.98 51.23,44.98 40.98,44.98 v29.48,44.98 25.48,44.98 19.27,38.77 JP1.2

### Text on the board
tNames: + | B- | G- | R- | + | B- | G- | R- | + | B- | G- | R- | 5V+ | 5V+ | LED3 | GND | TX | RX | LED4 | LED5 | GND | UART | DMX | GND | 3.3V+ | PDI | GND | GND | GND | 5V+ | LED0 | LED1 | LED2 | 5V+ | + | R- | G- | B- | + | R- | G- | B- | + | R- | G- | B-
bNames: DMX Led Controller - version 1.1 rev. A | UKA2013